# Altium schematic sheet Power_Diagram.SchDoc
size A4; SheetNumber: 4; SheetTotal: 14
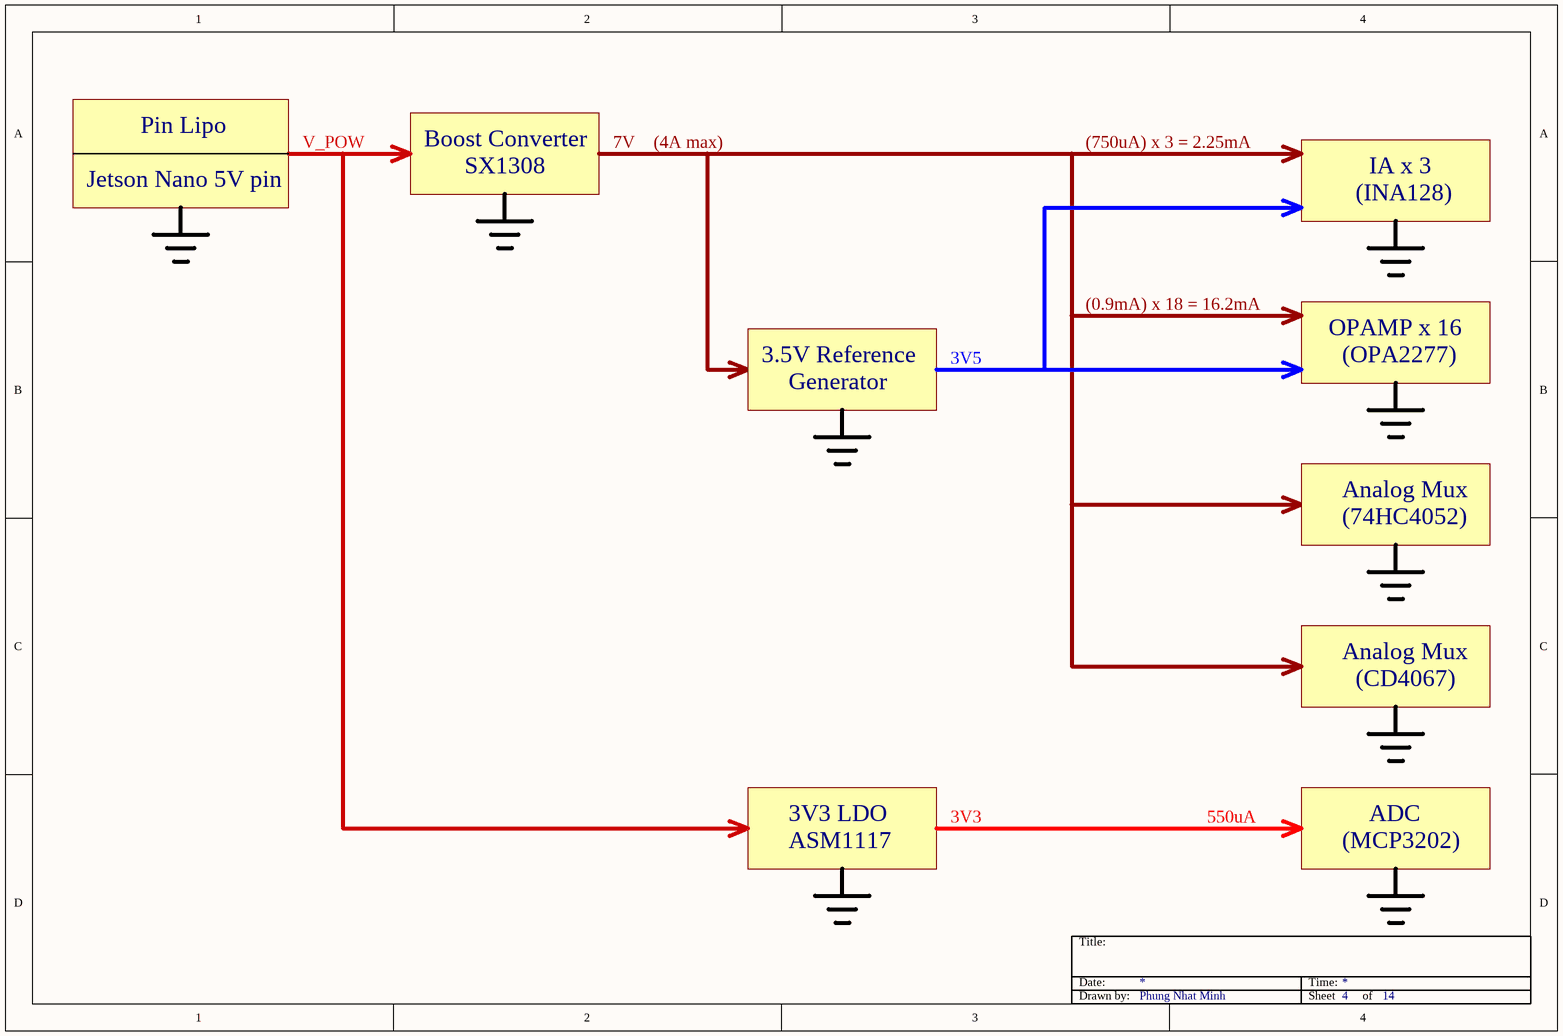
[diagram p0: Power_Diagram.SchDoc]

## Notes on the sheet
- Pin Lipo
- V_POW
- Boost Converter
- SX1308
- 7V
- (4A max)
- (750uA) x 3 = 2.25mA
- IA x 3
- Jetson Nano 5V pin
- (INA128)
- (0.9mA) x 18 = 16.2mA
- 3.5V Reference
- 3V5
- OPAMP x 16
- (OPA2277)
- Generator
- Analog Mux
- (74HC4052)
- (CD4067)
- 3V3 LDO
- ASM1117
- 3V3
- 550uA
- (MCP3202)
- ADC
- Title:
- Date:
- Time:
- Drawn by:
- Phung Nhat Minh
- Sheet
- of